# Altium schematic sheet mcu_gateway.SchDoc
size A3; SheetNumber: 2; SheetTotal: 2
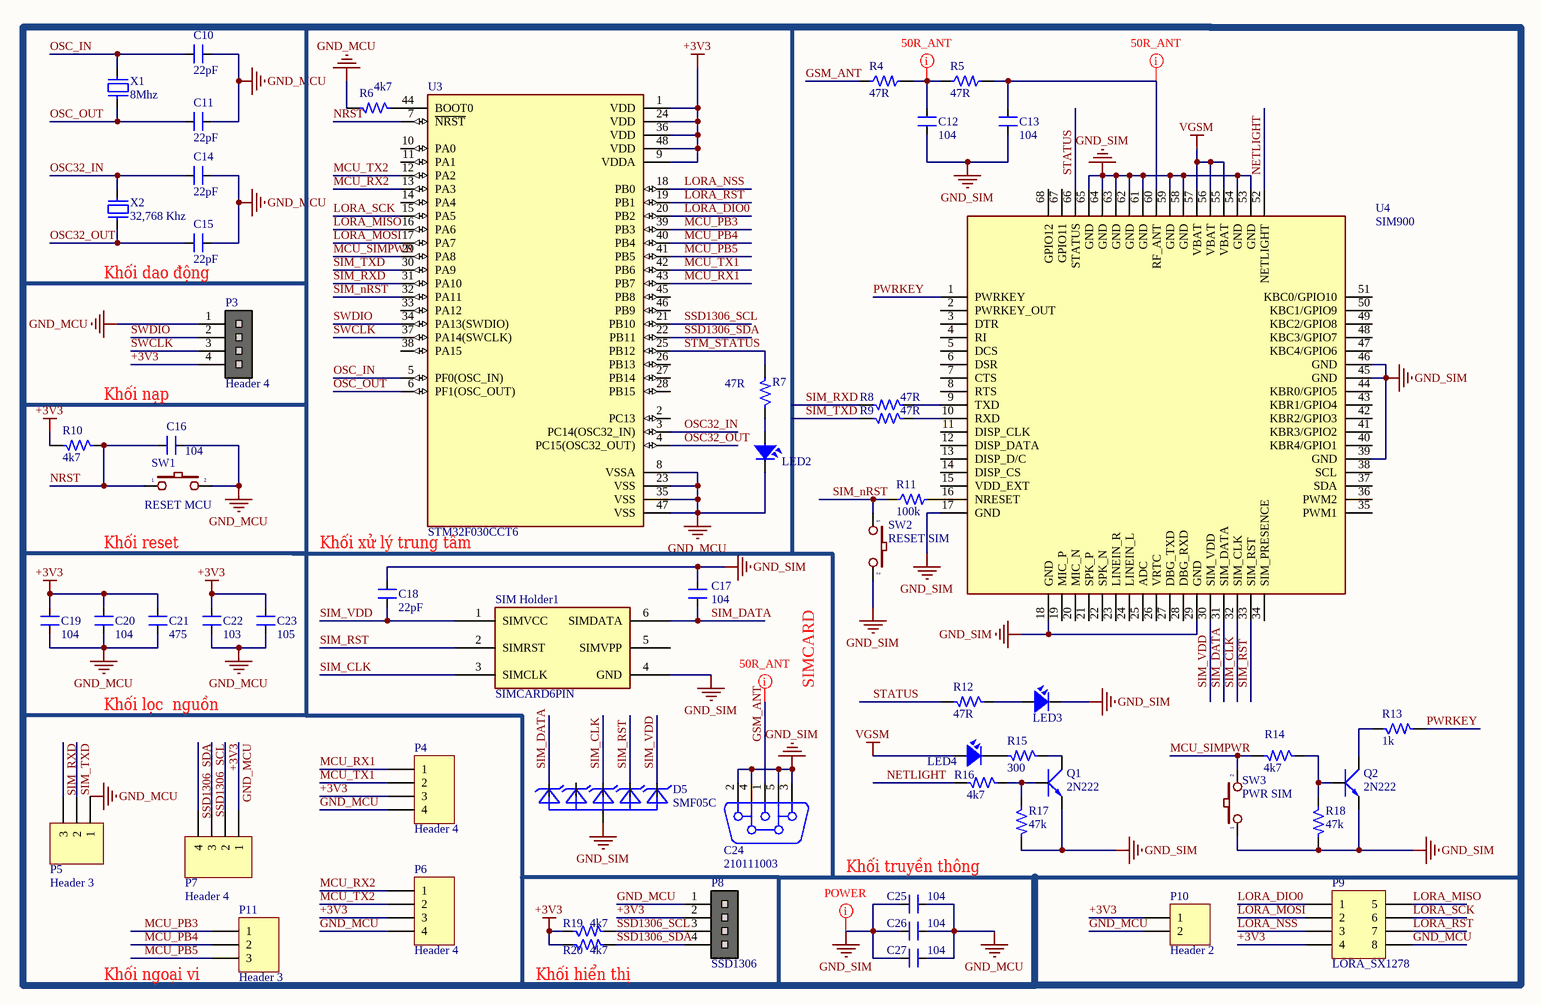
[diagram p0: mcu_gateway.SchDoc]

## Parts
C10  22pF  [SM-0805]
C11  22pF  [SM-0805]
C12  104  [SM-0805]
C13  104  [SM-0805]
C14  22pF  [SM-0805]
C15  22pF  [SM-0805]
C16  104  [SM-0805]
C17  104  [SM-0805]
C18  22pF  [SM-0805]
C19  104  [SM-0805]
C20  104  [SM-0805]
C21  475  [SM-0805]
C22  103  [SM-0805]
C23  105  [SM-0805]
C24  210111003  [SMA-RA]
C25  104  [SM-0805]
C26  104  [SM-0805]
C27  104  [SM-0805]
D5  SMF05C  [SC70-6]
LED2  LED  [LED-0805-Green]  (value not drawn)
LED3  LED  [LED-0805-Green]  (value not drawn)
LED4  LED  [LED-0805-Green]  (value not drawn)
P3  Header 4  [HDR 1X4]
P4  Header 4  [HDR1X4]
P5  Header 3  [HDR1X3]
P6  Header 4  [HDR1X4]
P7  Header 4  [HDR1X4]
P8  SSD1306  [HDR 1X4]
P9  LORA_SX1278  [HDR2X4_CEN]
P10  Header 2  [HDR1X2]
P11  Header 3  [HDR1X3]
Q1  2N222  [TO92-123]
Q2  2N222  [TO92-123]
R4  47R  [R-0805]
R5  47R  [R-0805]
R6  4k7  [R-0805]
R7  47R  [R-0805]
R8  47R  [R-0805]
R9  47R  [R-0805]
R10  4k7  [R-0805]
R11  100k  [R-0805]
R12  47R  [R-0805]
R13  1k  [R-0805]
R14  4k7  [R-0805]
R15  300  [R-0805]
R16  4k7  [R-0805]
R17  47k  [R-0805]
R18  47k  [R-0805]
R19  4k7  [R-0805]
R20  4k7  [R-0805]
SIM_Holder1  SIMCARD6PIN  [SIMCARD6pin]
SW1  RESET MCU  [SW1-SMD]
SW2  RESET SIM  [SW1-SMD]
SW3  PWR SIM  [SW1-SMD]
U3  STM32F030CCT6  [QFP50P900X900X160-48N]
U4  SIM900  [SIM900]
X1  8Mhz  [XT2]
X2  32,768 Khz  [XT32k]

## Nets
+3V3: C19.2 C20.2 C21.2 C22.2 C23.2 P3.4 P4.3 P6.3 P7.2 P8.2 P9.4 P10.1 R10.2 R19.1 R20.1 U3.1(VDD) U3.9(VDDA) U3.24(VDD) U3.36(VDD) U3.48(VDD)
GND_MCU: C10.1 C11.1 C14.1 C15.1 C16.2 C19.1 C20.1 C21.1 C22.1 C23.1 C25.2 C26.2 C27.2 LED2.2 P3.1 P4.4 P5.1 P6.4 P7.1 P8.1 P9.8 P10.2 R6.2 SW1.2 U3.8(VSSA) U3.23(VSS) U3.35(VSS) U3.47(VSS)
GND_SIM: C12.1 C13.1 C17.2 C18.2 C24.2 C24.3 C24.4 C24.5 C25.1 C26.1 C27.1 D5.2(A) LED3.2 Q1.1(E) Q2.1(E) R17.2 R18.2 SIM_Holder1.4(GND) SW2.2 SW3.1 U4.17(GND) U4.18(GND) U4.29(GND) U4.39(GND) U4.45(GND) U4.46(GND) U4.53(GND) U4.54(GND) U4.58(GND) U4.59(GND) U4.61(GND) U4.62(GND) U4.63(GND) U4.64(GND) U4.65(GND)
VGSM: LED4.1 U4.55(VBAT) U4.56(VBAT) U4.57(VBAT)
GSM_ANT: C24.1 R4.1
LORA_DIO0: P9.1 U3.20(PB2)
LORA_MISO: P9.5 U3.16(PA6)
LORA_MOSI: P9.2 U3.17(PA7)
LORA_NSS: P9.3 U3.18(PB0)
LORA_RST: P9.7 U3.19(PB1)
LORA_SCK: P9.6 U3.15(PA5)
MCU_PB3: P11.1 U3.39(PB3)
MCU_PB4: P11.2 U3.40(PB4)
MCU_PB5: P11.3 U3.41(PB5)
MCU_RX1: P4.1 U3.43(PB7)
MCU_RX2: P6.1 U3.13(PA3)
MCU_SIMPWR: R14.2 SW3.2 U3.29(PA8)
MCU_TX1: P4.2 U3.42(PB6)
MCU_TX2: P6.2 U3.12(PA2)
NETLIGHT: R16.2 U4.52(NETLIGHT)
NRST: C16.1 R10.1 SW1.1 U3.7(~{NRST})
OSC32_IN: C14.2 U3.3(PC14(OSC32_IN)) X2.2
OSC32_OUT: C15.2 U3.4(PC15(OSC32_OUT)) X2.1
OSC_IN: C10.2 U3.5(PF0(OSC_IN)) X1.2
OSC_OUT: C11.2 U3.6(PF1(OSC_OUT)) X1.1
PWRKEY: R13.2 U4.1(PWRKEY)
SIM_CLK: D5.4(C3) SIM_Holder1.3(SIMCLK) U4.32(SIM_CLK)
SIM_DATA: C17.1 D5.1(C1) SIM_Holder1.6(SIMDATA) U4.31(SIM_DATA)
SIM_nRST: R11.1 SW2.1 U3.32(PA11)
SIM_RST: D5.5(C4) SIM_Holder1.2(SIMRST) U4.33(SIM_RST)
SIM_RXD: P5.3 R8.2 U3.31(PA10)
SIM_TXD: P5.2 R9.2 U3.30(PA9)
SIM_VDD: C18.1 D5.6(C5) SIM_Holder1.1(SIMVCC) U4.30(SIM_VDD)
SSD1306_SCL: P7.3 P8.3 R19.2 U3.21(PB10)
SSD1306_SDA: P7.4 P8.4 R20.2 U3.22(PB11)
STATUS: R12.2 U4.66(STATUS)
STM_STATUS: R7.2 U3.25(PB12)
SWCLK: P3.3 U3.37(PA14(SWCLK))
SWDIO: P3.2 U3.34(PA13(SWDIO))
NetC12_2: C12.2 R4.2 R5.1
NetC13_2: C13.2 R5.2 U4.60(RF_ANT)
NetLED2_1: LED2.1 R7.1
NetLED3_1: LED3.1 R12.1
NetLED4_2: LED4.2 R15.2
NetQ1_2: Q1.2(B) R16.1 R17.1
NetQ1_3: Q1.3(C) R15.1
NetQ2_2: Q2.2(B) R14.1 R18.1
NetQ2_3: Q2.3(C) R13.1
NetR6_1: R6.1 U3.44(BOOT0)
NetR8_1: R8.1 U4.9(TXD)
NetR9_1: R9.1 U4.10(RXD)
NetR11_2: R11.2 U4.16(NRESET)

Not connected (* = marked no-connect by the designer): D5 3(C2); SIM_Holder1 5(SIMVPP); U3 2(PC13) 10(PA0) 11(PA1) 14(PA4) 26(PB13) 27(PB14) 28(PB15) 33(PA12) 38(PA15) 45(PB8) 46(PB9); U4 2(PWRKEY_OUT) 3(DTR) 4(RI) 5(DCS) 6(DSR) 7(CTS) 8(RTS) 11(DISP_CLK) 12(DISP_DATA) 13(DISP_D/C) 14(DISP_CS) 15(VDD_EXT) 19(MIC_P) 20(MIC_N) 21(SPK_P) 22(SPK_N) 23(LINEIN_R) 24(LINEIN_L) 25(ADC) 26(VRTC) 27(DBG_TXD) 28(DBG_RXD) 34(SIM_PRESENCE) 35(PWM1) 36(PWM2) 37(SDA) 38(SCL) 40(KBR4/GPIO1) 41(KBR3/GPIO2) 42(KBR2/GPIO3) 43(KBR1/GPIO4) 44(KBR0/GPIO5) 47(KBC4/GPIO6) 48(KBC3/GPIO7) 49(KBC2/GPIO8) 50(KBC1/GPIO9) 51(KBC0/GPIO10) 67(GPIO11) 68(GPIO12)

## Layout directives
net class 50R_ANT: GSM_ANT, NetC12_2, NetC13_2
net class POWER: GND_SIM

## Notes on the sheet
- (near C15) Khối dao động
- Khối nạp
- Khối reset
- Khối xử lý trung tâm
- Khối lọc  nguồn
- SIMCARD
- Khối truyền thông
- (near P11) Khối ngoại vi
- Khối hiển thị

## Library data of the parts
C10-C21 C23 C25-C27 = CM: Cap SMD; Value: 103
C22 = CM: Cap SMD; Value: 103
C24 = CON Ant: CONNECTOR ANTEN; Manufacturer: Würth Elektronik eiSos GmbH; partNo: 210111003; ComponentLink1Description: Manufacturer; ComponentLink1URL: http://www.we-online.de; Created by: Christin Zierenner; Created Date: May 2012; ComponentLink2Description: Datasheet; ComponentLink2URL: http://katalog.we-online.de/kataloge/eisos/index.php?language=en&pf=Filter_gerade
D5 = SMF05C: 12.5V Clamp 8A _8/20Âµs_ Ipp Tvs Diode Surface Mount SC-88/SC70-6/SOT-363; MF: ON Semiconductor; Availability: Unavailable; Price: None; Package: SOT-363 ON Semiconductor; Value: *; SnapEDA_Link: https://www.snapeda.com/parts/SMF05C/ON%20Semiconductor/view-part/2782704/?ref=snap; MP: SMF05C
LED2-LED4 = LED SMD: Value: LED 3 - 5 ly 2 Colour
P3 P4 P6-P8 = Header 4: Header, 4-Pin
  P4 P6 P7: LatestRevisionDate: 17-Jul-2002; LatestRevisionNote: Re-released for DXP Platform.; Publisher: Altium Limited
P5 P11 = Header 3: Header, 3-Pin; LatestRevisionDate: 17-Jul-2002; LatestRevisionNote: Re-released for DXP Platform.; Publisher: Altium Limited
P9 = Header 4X2A: Header, 4-Pin, Dual row; LatestRevisionDate: 17-Jul-2002; LatestRevisionNote: Re-released for DXP Platform.; Publisher: Altium Limited
P10 = Header 2: Header, 2-Pin; LatestRevisionDate: 17-Jul-2002; LatestRevisionNote: Re-released for DXP Platform.; Publisher: Altium Limited
Q1 Q2 = 2N222: NPN 600mW, ECB; Value: C1815; Creat by: MT-TECH.VN
R4-R12 R14-R20 = resistor: dien tro; value: 1k
R13 = resistor: dien tro; value: 1k
SW1-SW3 = SW2: Switch button 2 pin; Value: SW chip 2 pin
U3 = STM32F030CCT6: ARMÂ® CortexÂ®-M0 STM32F0 Microcontroller IC 32-Bit 48MHz 256KB _256K x 8_ FLASH 48-LQFP _7x7_; MF: STMicroelectronics; Value: *; Digi-Key_Purchase_URL: https://www.digikey.com.ar/product-detail/en/stmicroelectronics/STM32F030CCT6TR/497-17332-2-ND/6833532?utm_source=snapeda&utm_medium=aggregator&utm_campaign=symbol; MP: STM32F030CCT6; Package: LQFP-48 STMicroelectronics; SnapEDA_Link: https://www.snapeda.com/parts/STM32F030CCT6/STMicroelectronics/view-part/447161/?ref=snap; Digi-Key_Part_Number: 497-17332-2-ND
X1 = XT2: Crystal For all Crystal 2pin.; Value: 4Mhz
X2 = XT32k: Crystal 32,768kHz for timer real; Value: 32,768khz